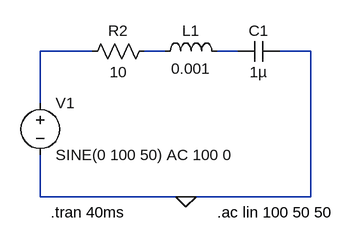
[diagram p0: schematic rlc.asc]
rlc.asc, the LTspice schematic file:
Version 4
SHEET 1 880 680
WIRE 80 144 0 144
WIRE 192 144 160 144
WIRE 304 144 272 144
WIRE 416 144 368 144
WIRE 0 224 0 144
WIRE 0 368 0 304
WIRE 224 368 0 368
WIRE 416 368 416 144
WIRE 416 368 224 368
FLAG 224 368 0
SYMBOL voltage 0 208 R0
SYMATTR InstName V1
SYMATTR Value SINE(0 100 50) AC 100 0
SYMBOL res 176 128 R90
WINDOW 0 0 56 VBottom 2
WINDOW 3 32 56 VTop 2
SYMATTR InstName R2
SYMATTR Value 10
SYMBOL ind 176 160 R270
WINDOW 0 32 56 VTop 2
WINDOW 3 5 56 VBottom 2
SYMATTR InstName L1
SYMATTR Value 0.001
SYMBOL cap 368 128 R90
WINDOW 0 0 32 VBottom 2
WINDOW 3 32 32 VTop 2
SYMATTR InstName C1
SYMATTR Value 1µ
TEXT 272 392 Left 2 !.ac lin 100 50 50
TEXT 16 392 Left 2 !.tran 40ms

The netlist it stands for:
* rlc.asc
V1 N001 0 SINE(0 100 50) AC 100 0
R2 N002 N001 10
L1 N002 N003 0.001
C1 0 N003 1µ
.ac lin 100 50 50
.tran 40ms
.backanno
.end